# EAGLE design Ultravolt Board (EAGLE 9.0.1)

## Sheet 1 of 2
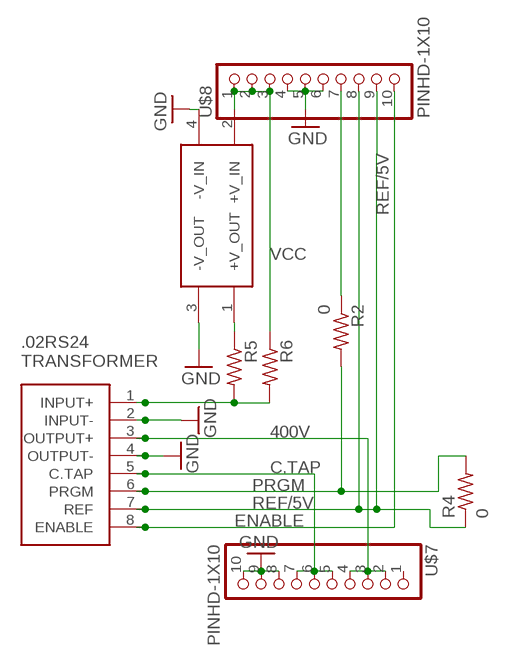
[diagram p0: schematic, sheet 1]

### Parts
$ZX2  LUCAS-LIBRARY_12_DC-24_DC  [LUCAS-LIBRARY_12_DC-24_DC]
R2  0  R-US_M1206  [M1206]
R4  0  R-US_M1206  [M1206]
R5  ADAFRUIT_R-US_M0805  [ADAFRUIT_M0805]
R6  ADAFRUIT_R-US_M0805  [ADAFRUIT_M0805]
U$1  ULTRAVOLT_DAUGHTERBOARD_BAT-BOARD-REV-2.0_LUCAS-LIBRARY_.2RS24_TRANSFORMER  [ULTRAVOLT_DAUGHTERBOARD_BAT-BOARD-REV-2.0_LUCAS-LIBRARY_0.2RS24_TRANSFORMER]
U$7  PINHD-1X10  [1X10-BIG]
U$8  PINHD-1X10  [1X10-BIG]

### Nets
24V: $ZX2.1(+V_OUT) R5.1
400V: U$1.3(OUTPUT+) U$7.2 U$7.3 U$7.4
C.TAP: U$1.5(C.TAP) U$7.5 U$7.6 U$7.7
ENABLE: U$1.8(ENABLE) U$8.10
GND: $ZX2.3(-V_OUT) $ZX2.4(-V_IN) U$1.2(INPUT-) U$1.4(OUTPUT-) U$7.8 U$7.9 U$7.10 U$8.4 U$8.5 U$8.6
N$1: R2.1 U$8.7
N$32: R5.2 R6.2 U$1.1(INPUT+)
PRGM: R2.2 R4.2 U$1.6(PRGM)
REF/5V: R4.1 U$1.7(REF) U$8.8 U$8.9
VCC: $ZX2.2(+V_IN) R6.1 U$8.1 U$8.2 U$8.3
Unconnected: U$7.1

## Sheet 2 of 2

## Library data of the parts
$ZX2 = bat-board rev 2.0:LUCAS-LIBRARY_12_DC-24_DC
R2 R4 = resistor:R-US_: RESISTOR, American symbol; SPICEPREFIX: R
R5 R6 = bat-board rev 2.0:ADAFRUIT_R-US_: RESISTOR, American symbol
U$1 = ultravolt_daughterboard:ULTRAVOLT_DAUGHTERBOARD_BAT-BOARD-REV-2.0_LUCAS-LIBRARY_.2RS24_TRANSFORMER
U$7 U$8 = adafruit:PINHD-1X10: Pin header 1x10 0.1" spacing With round pins

## Board
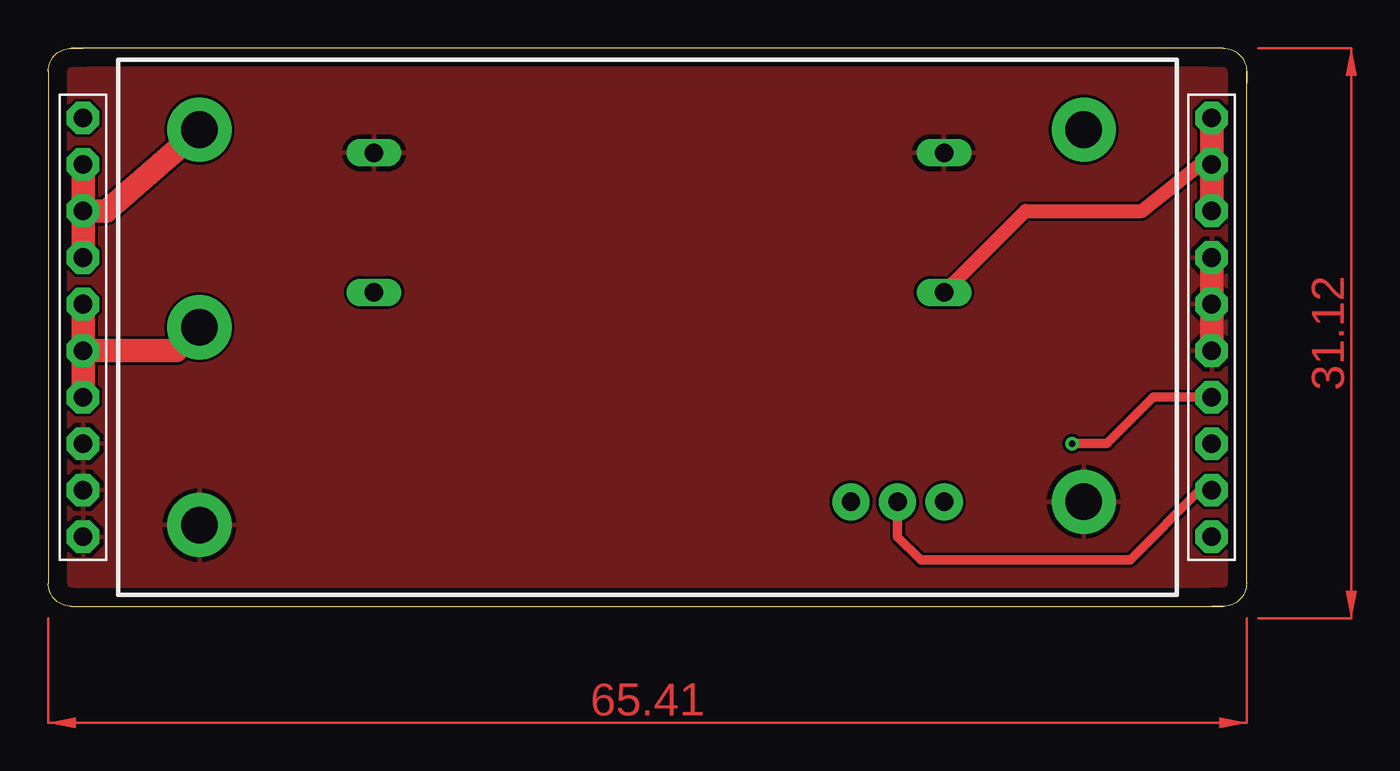
[diagram p1: board, top side]
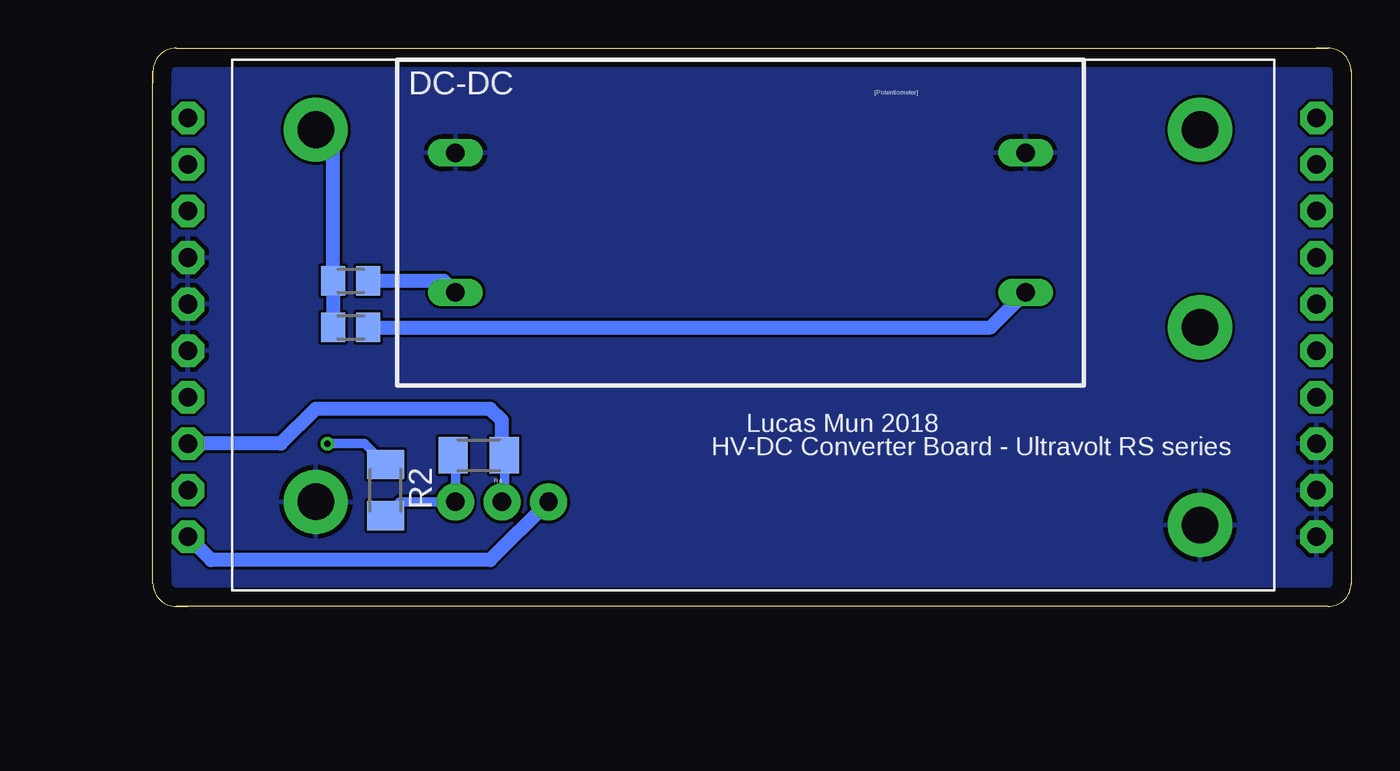
[diagram p2: board, bottom side, seen from below]

Size 65.41 x 30.48 mm. Coordinates in mm from the lower left corner, seen from the top.
Outline: 63.5,0 1.27,0 arc-90 0,1.27 0,28.57
Outline: 63.5,0 64.14,0
Outline: 65.41,1.27 65.41,1.91
Outline: 65.41,1.91 65.41,28.57
Outline: 65.41,28.57 65.41,29.21
Outline: 64.14,30.48 63.5,30.48
Outline: 63.5,30.48 1.91,30.48
Outline: 1.91,30.48 1.27,30.48
Outline: 0,29.21 0,28.57
Outline: 0,29.21 arc-90 1.27,30.48
Outline: 64.14,30.48 arc-90 65.41,29.21
Outline: 65.41,1.27 arc-90 64.14,0
Outline: 65.41,1.27 65.41,1.91
Outline: 64.14,0 63.5,0
Outline: 64.14,30.48 63.5,30.48
Outline: 65.41,29.21 65.41,28.57
Outline: 1.27,30.48 1.91,30.48
Outline: 0,29.21 0,28.57
Copper layers (1*16): Top 0.035mm / dielectric 1.5mm / Bottom 0.035mm
Design rules "default": minimum track width 6mil, minimum drill 0.35mm, track to track 6mil, track to pad 6mil, pad to pad 6mil, via to via 6mil, smd to smd 6mil, copper to edge 40mil, drill to drill 6mil, minimum pad ring 10mil, minimum via ring 8mil, stop-mask expansion 4mil, vias tented up to drill 0mil, thermal gap 10mil

### Footprints (pad centres in the part's own frame; a part is rotated, then mirrored left to right if it is on the bottom)
LUCAS-LIBRARY_12_DC-24_DC = drill 1 long: 1 -15.875,3.81; 2 15.24,3.81; 3 -15.875,-3.81; 4 15.24,-3.81
M1206 = smd 1.6 x 2: 1 -1.4,0; 2 1.4,0
ADAFRUIT_M0805 = smd 1.3 x 1.6: 1 -0.95,0; 2 0.95,0
ULTRAVOLT_DAUGHTERBOARD_BAT-BOARD-REV-2.0_LUCAS-LIBRARY_0.2RS24_TRANSFORMER = drill 2 pad 3.5: 1 25.4,12.065; 2 25.4,-8.255; 3 -22.86,12.065; 4 -22.86,-9.525; 5 -22.86,1.27 | drill 1 pad 2.032: 6 17.78,-8.255; 7 15.24,-8.255; 8 12.7,-8.255
1X10-BIG = drill 1.016 pad 1.778 octagon: 1 -11.43,0; 2 -8.89,0; 3 -6.35,0; 4 -3.81,0; 5 -1.27,0; 6 1.27,0; 7 3.81,0; 8 6.35,0; 9 8.89,0; 10 11.43,0

### Placement (x,y rotation side)
$ZX2  33.66,20.95 180 bottom
R2  52.7,6.35 270 bottom
R4  47.62,8.26 180 bottom
R5  54.61,15.24 180 bottom
R6  54.61,17.78 180 bottom
U$1  31.11,13.97 0 top
U$7  1.91,15.24 270 top
U$8  63.5,15.24 270 top

### Tracks (layer width: path | path; a pad name or v marks a point on that pad's centre or on a via)
24V
  Bottom 0.762: R5.1 19.68,15.24 $ZX2.1
400V
  Top 1.27: U$7.2 U$7.3 | U$7.3 U$7.4 | U$7.3 3.17,21.59 U$1.3
C.TAP
  Top 1.27: U$7.5 U$7.6 | U$7.6 U$7.7 | U$7.6 6.99,13.97 U$1.5
ENABLE
  Bottom 0.762: U$1.8 46.99,2.54 62.23,2.54 U$8.10
GND
  Top 1.27: U$8.4 U$8.5 U$8.6
  pour Bottom: -0.64,-1.27 66.67,-1.27 66.67,31.75 -0.64,31.75
  pour Top: 66.04,31.11 66.04,-0.64 0,-0.64 0,31.11
N$1  (via drill 0.35)
  Top 0.508: v55.88,8.89 57.78,8.89 60.33,11.43 U$8.7
  Bottom 0.508: R2.1 53.84,8.89 v55.88,8.89
N$32
  Bottom 0.762: U$1.1 55.56,25.08 R6.2 R5.2
PRGM
  Bottom 0.508: R4.2 48.9,8.12 U$1.6 51.94,5.71 R2.2
REF/5V
  Top 0.508: U$1.7 46.35,3.81 47.62,2.54 59.05,2.54 62.87,6.35 U$8.9
  Bottom 0.508: U$1.7 46.23,5.84 R4.1
  Bottom 0.762: 46.35,8.12 R4.1 46.35,8.38 46.35,10.16 46.99,10.79 56.52,10.79 58.42,8.89 U$8.8
VCC
  Top 0.762: $ZX2.2 53.34,21.59 59.69,21.59 62.87,24.13 U$8.2
  Top 1.27: U$8.3 U$8.2 U$8.1
  Bottom 0.762: R6.1 49.53,17.78 $ZX2.2
(copper drawn outside any net)
  shapes: Top area x2

### Text on the board
bPlace: [Potentiometer] | Lucas Mun 2018 | HV-DC Converter Board - Ultravolt RS series